# Altium schematic sheet WiFiNode_CPU2_R00.SchDoc: Node WiFi
size A4; Author: Hernan M. Travado; Revision: 0; SheetNumber: 5; SheetTotal: 5
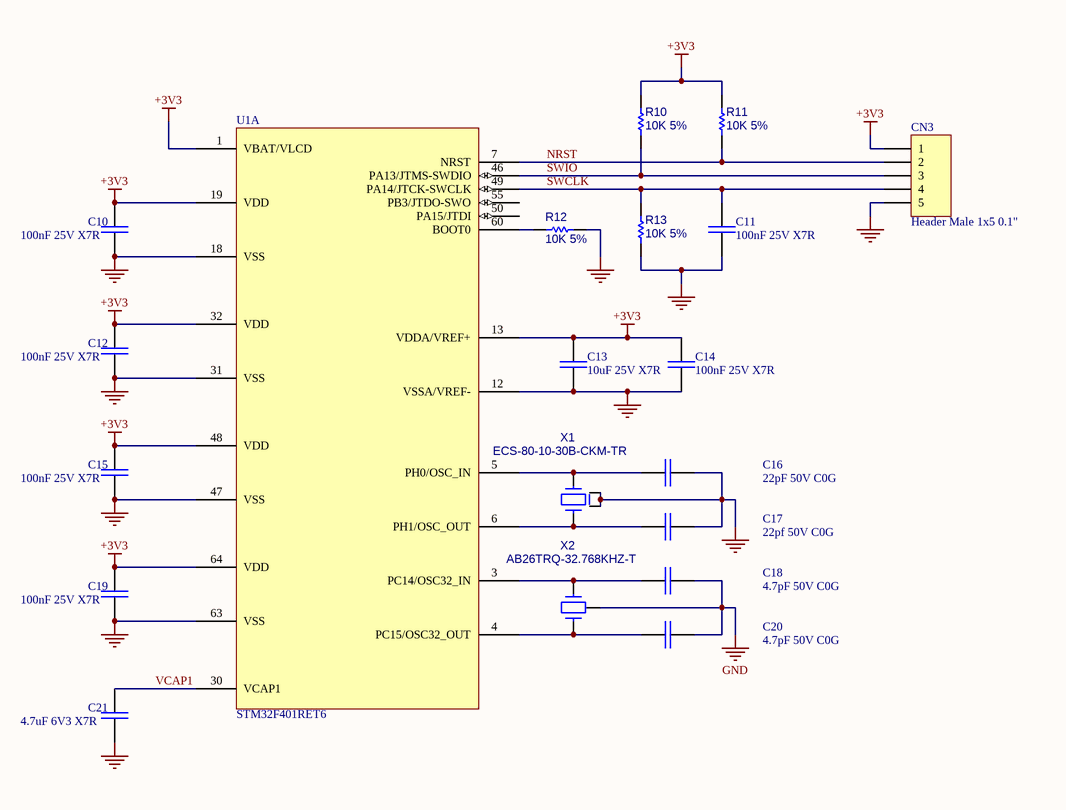
[diagram p0: WiFiNode_CPU2_R00.SchDoc]

## Parts
C10  100nF 25V X7R  [C_0805]
C11  100nF 25V X7R  [C_0805]
C12  100nF 25V X7R  [C_0805]
C13  10uF 25V X7R  [C_0805]
C14  100nF 25V X7R  [C_0805]
C15  100nF 25V X7R  [C_0805]
C16  22pF 50V C0G  [C_0805]
C17  22pf 50V C0G  [C_0805]
C18  4.7pF 50V C0G  [C_0805]
C19  100nF 25V X7R  [C_0805]
C20  4.7pF 50V C0G  [C_0805]
C21  4.7uF 6V3 X7R  [C_0805]
CN3  Header Male 1x5 0.1"  [Header_M_1x5_0.1"]
R10  10K 5%  [R_0805]
R11  10K 5%  [R_0805]
R12  10K 5%  [R_0805]
R13  10K 5%  [R_0805]
U1  STM32F401RET6  [LQFP_64]  (part A of 2)
X1  ECS-80-10-30B-CKM-TR  [ABM3C]
X2  AB26TRQ-32.768KHZ-T  [AB26TQF]

## Nets
+3V3: C10.1 C12.1 C13.1 C14.1 C15.1 C19.1 CN3.1 R10.1 R11.1 U1.1(VBAT/VLCD) U1.13(VDDA/VREF+) U1.19(VDD) U1.32(VDD) U1.48(VDD) U1.64(VDD)
GND: C10.2 C11.2 C12.2 C13.2 C14.2 C15.2 C16.2 C17.2 C18.2 C19.2 C20.2 C21.2 CN3.5 R12.1 R13.2 U1.12(VSSA/VREF-) U1.18(VSS) U1.31(VSS) U1.47(VSS) U1.63(VSS) X1.2 X1.4 X2.3
NRST: CN3.2 R11.2 U1.7(NRST)
SWCLK: C11.1 CN3.4 R13.1 U1.49(PA14/JTCK-SWCLK)
SWIO: CN3.3 R10.2 U1.46(PA13/JTMS-SWDIO)
VCAP1: C21.1 U1.30(VCAP1)
NetC16_1: C16.1 U1.5(PH0/OSC_IN) X1.1
NetC17_1: C17.1 U1.6(PH1/OSC_OUT) X1.3
NetC18_1: C18.1 U1.3(PC14/OSC32_IN) X2.2
NetC20_1: C20.1 U1.4(PC15/OSC32_OUT) X2.1
NetR12_2: R12.2 U1.60(BOOT0)

Not connected (* = marked no-connect by the designer): U1 50(PA15/JTDI) 55(PB3/JTDO-SWO)

## Notes on the sheet
- Title:
- Size:
- Author:
- A4
- Sheet
- of
- Revision:
- File:
- Date:

## Library data of the parts
C10-C21 = Ceramic capacitor
CN3 = CONN_05P: Connector Generic 5 Vias
R10-R13 = Res1: Resistor
U1 = STM32F401RE
X1 = CRYSTAL_4P: Crystal 4 Vias + GND
X2 = CRYSTAL 3P: Crystal 2 Vias + GND